# Altium schematic sheet SODONGUYENLY.schdoc
size A4
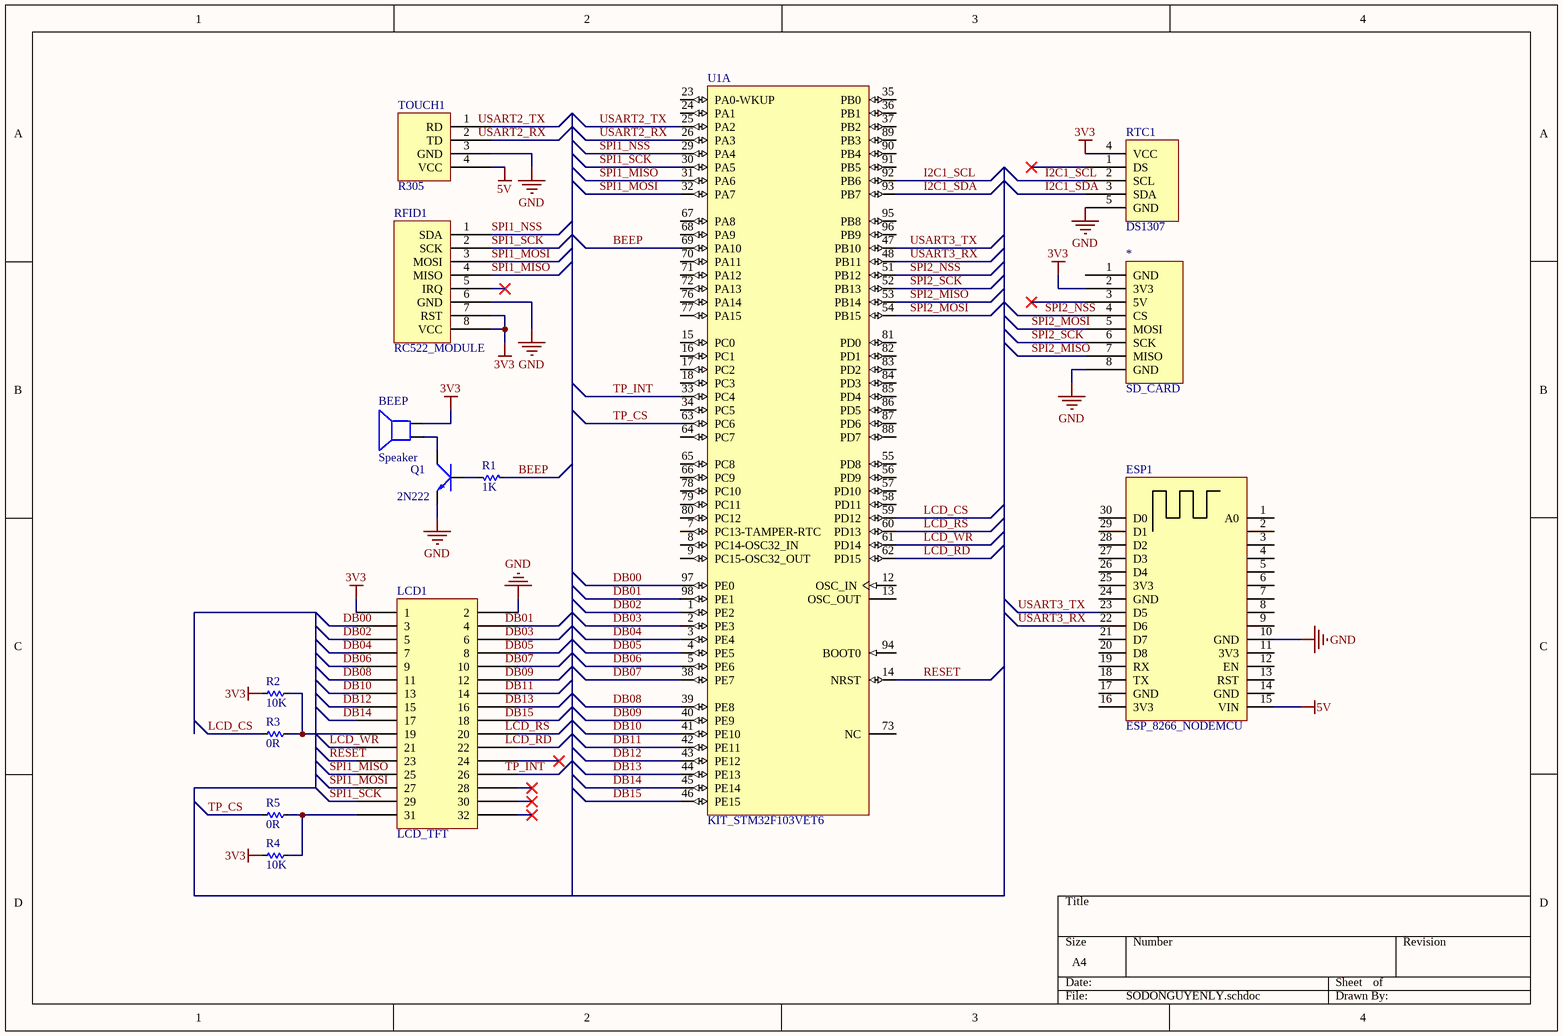
[diagram p0: SODONGUYENLY.schdoc]

## Parts
*  SD_CARD
BEEP  Speaker  [SPEAKER]
ESP1  ESP_8266_NODEMCU  [Node MCU]
LCD1  LCD_TFT
Q1  2N222  [TO92-123]
R1  1K  [RES-1/2W]
R2  10K  [RES-1/2W]
R3  0R  [RES-1/2W]
R4  10K  [RES-1/2W]
R5  0R  [RES-1/2W]
RFID1  RC522_MODULE
RTC1  DS1307
TOUCH1  R305
U1  KIT_STM32F103VET6  [STM-LQFP100_N]  (part A of 2)  (graphical)

## Nets
3V3: *.2(3V3) BEEP.1 LCD1.1 R2.2 R4.2 RFID1.7(RST) RFID1.8(VCC) RTC1.4(VCC)
5V: ESP1.15(VIN) TOUCH1.4(VCC)
GND: *.8(GND) ESP1.10(GND) LCD1.2 Q1.1(E) RFID1.6(GND) RTC1.5(GND) TOUCH1.3(GND)
BEEP: R1.2 U1.69(PA10)
DB00: LCD1.3 U1.97(PE0)
DB01: U1.98(PE1)
DB02: LCD1.5 U1.1(PE2)
DB03: U1.2(PE3)
DB04: LCD1.7 U1.3(PE4)
DB05: U1.4(PE5)
DB06: LCD1.9 U1.5(PE6)
DB07: U1.38(PE7)
DB08: LCD1.11 U1.39(PE8)
DB09: U1.40(PE9)
DB10: LCD1.13 U1.41(PE10)
DB11: U1.42(PE11)
DB12: LCD1.15 U1.43(PE12)
DB13: U1.44(PE13)
DB14: LCD1.17 U1.45(PE14)
DB15: U1.46(PE15)
I2C1_SCL: RTC1.2(SCL) U1.92(PB6)
I2C1_SDA: RTC1.3(SDA) U1.93(PB7)
LCD_CS: R3.2 U1.59(PD12)
LCD_RD: U1.62(PD15)
LCD_RS: U1.60(PD13)
LCD_WR: LCD1.21 U1.61(PD14)
RESET: LCD1.23 U1.14(NRST)
SPI1_MISO: LCD1.25 RFID1.4(MISO) U1.31(PA6)
SPI1_MOSI: LCD1.27 RFID1.3(MOSI) U1.32(PA7)
SPI1_NSS: RFID1.1(SDA) U1.29(PA4)
SPI1_SCK: LCD1.29 RFID1.2(SCK) U1.30(PA5)
SPI2_MISO: *.7(MISO) U1.53(PB14)
SPI2_MOSI: *.5(MOSI) U1.54(PB15)
SPI2_NSS: *.4(CS) U1.51(PB12)
SPI2_SCK: *.6(SCK) U1.52(PB13)
TP_CS: R5.2 U1.63(PC6)
TP_INT: U1.33(PC4)
USART2_RX: U1.26(PA3)
USART2_TX: U1.25(PA2)
USART3_RX: ESP1.22(D6) U1.48(PB11)
USART3_TX: ESP1.23(D5) U1.47(PB10)
NetBEEP_2: BEEP.2 Q1.3(C)
NetLCD1_19: LCD1.19 R2.1 R3.1
NetLCD1_31: LCD1.31 R4.1 R5.1
NetQ1_2: Q1.2(B) R1.1

Not connected (* = marked no-connect by the designer): * 1(GND) 3(5V)*; ESP1 1(A0) 2 3 4 5 6 7 8 9 11(3V3) 12(EN) 13(RST) 14(GND) 16(3V3) 17(GND) 18(TX) 19(RX) 20(D8) 21(D7) 24(GND) 25(3V3) 26(D4) 27(D3) 28(D2) 29(D1) 30(D0); LCD1 4 6 8 10 12 14 16 18 20 22 24* 26 28* 30* 32*; RFID1 5(IRQ)*; RTC1 1(DS)*; TOUCH1 1(RD) 2(TD); U1 7(PC13-TAMPER-RTC) 8(PC14-OSC32_IN) 9(PC15-OSC32_OUT) 12(OSC_IN) 13(OSC_OUT) 15(PC0) 16(PC1) 17(PC2) 18(PC3) 23(PA0-WKUP) 24(PA1) 34(PC5) 35(PB0) 36(PB1) 37(PB2) 55(PD8) 56(PD9) 57(PD10) 58(PD11) 64(PC7) 65(PC8) 66(PC9) 67(PA8) 68(PA9) 70(PA11) 71(PA12) 72(PA13) 73(NC) 76(PA14) 77(PA15) 78(PC10) 79(PC11) 80(PC12) 81(PD0) 82(PD1) 83(PD2) 84(PD3) 85(PD4) 86(PD5) 87(PD6) 88(PD7) 89(PB3) 90(PB4) 91(PB5) 94(BOOT0) 95(PB8) 96(PB9)

## Notes on the sheet
- Labels drawn without touching a wire or pin: DB01, DB03, DB05, DB07, DB09, DB11, DB13, DB15, LCD_RD, LCD_RS, TP_INT, USART2_RX, USART2_TX

## Library data of the parts
BEEP = Speaker: Loudspeaker; Published: 24-Mar-1999; LatestRevisionDate: 17-Jul-2002; LatestRevisionNote: Re-released for DXP Platform.; PackageReference: PIN2; Publisher: Altium Limited
ESP1 = NodeMCU
LCD1 = LCD
Q1 = 2N222: NPN 600mW, ECB; Value: C1815
R1-R5 = Res: Manufacturer: Generic Components; Class: Passive; SubClass: R; Published: 08/06/2000; Publisher: Altium Hobart Technology Centre
RFID1 = RFID
RTC1 = DS1307_2
U1 = STM32F103VET6: ARM Cortex-M3 32-bit MCU, 512 KB Flash, 64 KB Internal RAM, 80 I/Os, 100-pin LQFP, -40 to 85 degC, Tray; A/D Converter: 3x12-bit (16 Channel); D/A Converter: 2x12-bit (2 Channel); FLASH Size (Prog) (kB): 512; I/Os (High Current): 80; Internal RAM Size (kB): 64; Operating Frequency(F) (Processor speed) (MHz): 72; Supply Voltage(Vcc) min (V): 2; DatasheetVersion: Rev. 8; PackageVersion: Rev. 1, 06/2013; PackageReference: LQFP100; PackageDescription: 100-Pin Low Profile Quad Flat Package, 14 x 14 mm Body, 0.5 mm Pitch; Supplier 1: Digi-Key; Supplier Part Number 1: 497-6443-ND; Supplier 2: Farnell; Supplier Part Number 2: 1624141; Supplier 3: Newark; Supplier Part Number 3: 01P4104; Supplier 4: Newark; Supplier Part Number 4: 57P1260; Supplier 5: Mouser; Supplier Part Number 5: 511-STM32F103VET6; Core: ARM Cortex-M3; Packing: Tray; Mounting Technology: Surface Mount; PartNumber: STM32F103VET6; ComponentLink1Description: Manufacturer URL; ComponentLink1URL: http://www.st.com/web/en/home.html; ComponentLink2Description: Datasheet; ComponentLink2URL: http://www.st.com/st-web-ui/static/active/en/resource/technical/document/datasheet/CD00191185.pdf; ComponentLink3Description: Package Specification; ComponentLink3URL: http://www.st.com/st-web-ui/static/active/en/resource/technical/document/data_brief/DM00071938.pdf